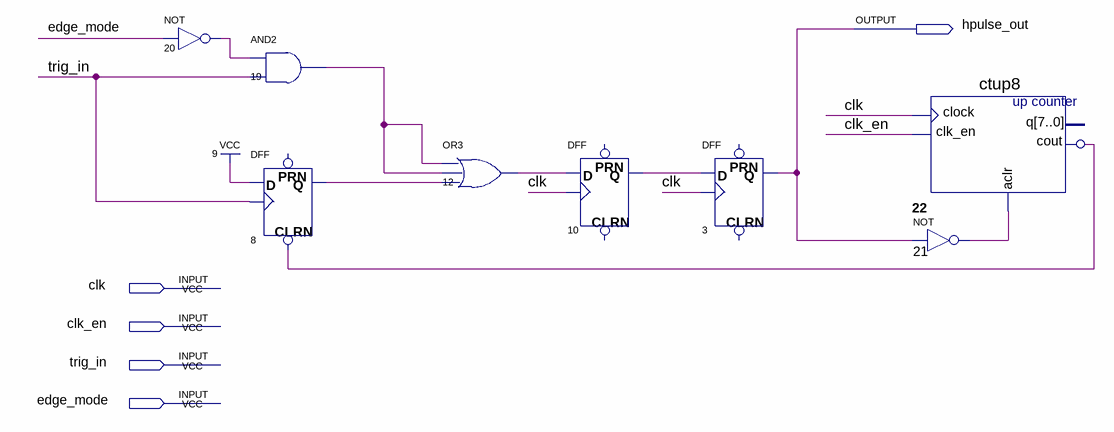
[diagram p0: schematic sheet]
// Quartus schematic mono.bdf as structural Verilog: 8 symbols, 5 pins
module mono (
  input  clk,
  input  clk_en,
  input  trig_in,
  input  edge_mode,
  output hpulse_out
);

  wire n8_q, n10_q, n12_out, n19_out, n20_out, n21_out, n22_cout, n22_cout_inverted_out;

  not u_20 (n20_out, edge_mode);
  and u_19 (n19_out, n20_out, trig_in);
  DFF u_8 (.CLRN(n22_cout_inverted_out), .CLK(trig_in), .D(1'b1), .Q(n8_q));  // open: PRN
  or u_12 (n12_out, n19_out, n19_out, n8_q);
  DFF u_10 (.CLK(clk), .D(n12_out), .Q(n10_q));  // open: CLRN, PRN
  DFF u_3 (.CLK(clk), .D(n10_q), .Q(hpulse_out));  // open: CLRN, PRN
  ctup8 u_22 (.clock(clk), .clk_en(clk_en), .aclr(n21_out), .cout(n22_cout));  // open: q
  not u_22_cout_inverted (n22_cout_inverted_out, n22_cout);
  not u_21 (n21_out, hpulse_out);
endmodule
